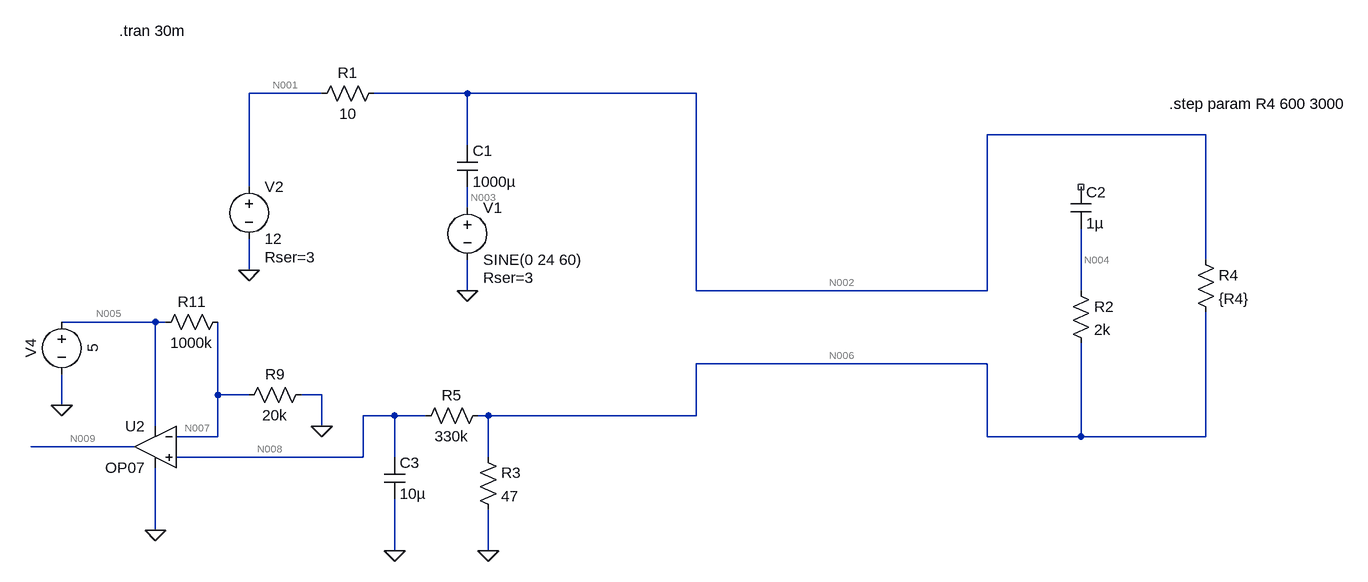
[diagram p0: schematic pbx.asc]
pbx.asc, the LTspice schematic file:
Version 4
SHEET 1 1648 1044
WIRE 16 32 -96 32
WIRE 240 32 96 32
WIRE 592 32 240 32
WIRE 1376 96 1040 96
WIRE 240 112 240 32
WIRE -96 176 -96 32
WIRE 240 208 240 176
WIRE 1376 288 1376 96
WIRE -96 304 -96 256
WIRE 240 336 240 288
WIRE 592 336 592 32
WIRE 1040 336 1040 96
WIRE 1040 336 592 336
WIRE 1184 336 1184 240
WIRE -240 384 -384 384
WIRE -224 384 -240 384
WIRE 1040 448 592 448
WIRE -144 496 -144 384
WIRE -96 496 -144 496
WIRE 16 496 -16 496
WIRE -384 512 -384 464
WIRE 128 528 80 528
WIRE 176 528 128 528
WIRE 272 528 256 528
WIRE 592 528 592 448
WIRE 592 528 272 528
WIRE -240 544 -240 384
WIRE 16 544 16 496
WIRE -144 560 -144 496
WIRE -144 560 -208 560
WIRE 1040 560 1040 448
WIRE 1184 560 1184 416
WIRE 1184 560 1040 560
WIRE 1376 560 1376 368
WIRE 1376 560 1184 560
WIRE -272 576 -432 576
WIRE 80 592 80 528
WIRE 80 592 -208 592
WIRE 128 592 128 528
WIRE 272 592 272 528
WIRE -240 704 -240 608
WIRE 128 736 128 656
WIRE 272 736 272 672
FLAG 240 336 0
FLAG -96 304 0
FLAG 272 736 0
FLAG 128 736 0
FLAG -240 704 0
FLAG 16 544 0
FLAG -384 512 0
SYMBOL voltage 240 192 R0
WINDOW 123 0 0 Left 0
WINDOW 39 24 124 Left 2
SYMATTR SpiceLine Rser=3
SYMATTR InstName V1
SYMATTR Value SINE(0 24 60)
SYMBOL voltage -96 160 R0
WINDOW 123 0 0 Left 0
WINDOW 39 24 124 Left 2
SYMATTR SpiceLine Rser=3
SYMATTR InstName V2
SYMATTR Value 12
SYMBOL cap 224 112 R0
SYMATTR InstName C1
SYMATTR Value 1000µ
SYMBOL res 0 48 R270
WINDOW 0 32 56 VTop 2
WINDOW 3 0 56 VBottom 2
SYMATTR InstName R1
SYMATTR Value 10
SYMBOL cap 1168 176 R0
SYMATTR InstName C2
SYMATTR Value 1µ
SYMBOL res 1168 320 R0
SYMATTR InstName R2
SYMATTR Value 2k
SYMBOL res 256 576 R0
SYMATTR InstName R3
SYMATTR Value 47
SYMBOL res 1360 272 R0
SYMATTR InstName R4
SYMATTR Value {R4}
SYMBOL cap 112 592 R0
SYMATTR InstName C3
SYMATTR Value 10µ
SYMBOL res 272 512 R90
WINDOW 0 0 56 VBottom 2
WINDOW 3 32 56 VTop 2
SYMATTR InstName R5
SYMATTR Value 330k
SYMBOL res 0 480 R90
WINDOW 0 0 56 VBottom 2
WINDOW 3 32 56 VTop 2
SYMATTR InstName R9
SYMATTR Value 20k
SYMBOL res -128 368 R90
WINDOW 0 0 56 VBottom 2
WINDOW 3 32 56 VTop 2
SYMATTR InstName R11
SYMATTR Value 1000k
SYMBOL voltage -384 368 R0
WINDOW 0 -32 56 VBottom 2
WINDOW 3 32 56 VTop 2
WINDOW 123 0 0 Left 0
WINDOW 39 0 0 Left 0
SYMATTR InstName V4
SYMATTR Value 5
SYMBOL Opamps\\OP07 -240 512 M0
SYMATTR InstName U2
TEXT 1320 48 Left 2 !.step param R4 600 3000
TEXT -296 -64 Left 2 !.tran 30m

The netlist it stands for:
* pbx.asc
V1 N003 0 SINE(0 24 60) Rser=3
V2 N001 0 12 Rser=3
C1 N002 N003 1000µ
R1 N001 N002 10
C2 NC_01 N004 1µ
R2 N004 N006 2k
R3 N006 0 47
R4 N002 N006 {R4}
C3 N008 0 10µ
R5 N006 N008 330k
R9 0 N007 20k
R11 N007 N005 1000k
V4 N005 0 5
XU2 N008 N007 N005 0 N009 LT1001  ; OP07, pins In+ In- V+ V- OUT
.step param R4 600 3000
.tran 30m
.lib LTC.lib
.backanno
.end

* Results of the author's LTspice run, read from the files saved beside the schematic
* Operating Point (first step), zero values left out:
*   r4 = 600 
*   V(n001) = 11.95 V
*   V(n002) = 11.76 V
*   V(n004) = 854.5 mV
*   V(n006) = 854.5 mV
*   V(n008) = 851.2 mV
*   V(n007) = 98.24 mV
*   V(n005) = 5 V
*   V(n009) = 4.07 V
*   I(R11) = -4.902 µA
*   I(R9) = -4.912 µA
*   I(R5) = 10.16 nA
*   I(R4) = 18.18 mA
*   I(R3) = 18.18 mA
*   I(R1) = 18.18 mA
*   I(V4) = -2.252 mA
*   I(V2) = -18.18 mA
*   Ix(u2:1) = 10.16 nA
*   Ix(u2:2) = -10.17 nA
*   Ix(u2:3) = 2.247 mA
*   Ix(u2:4) = -2.253 mA
*   Ix(u2:5) = -3.14 pA
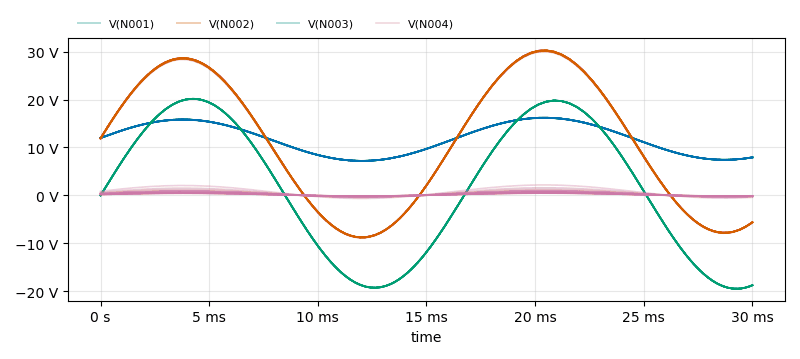
[diagram p1: Transient Analysis of pbx.asc, plotted from the saved traces]
* Transient Analysis, 11 runs:
*   V(N001) [r4=600]: min 7.185 V, max 16.16 V, average 11.82 V, rms 12.23 V, last 7.917 V
*   V(N001) [r4=840]: min 7.195 V, max 16.18 V, average 11.84 V, rms 12.25 V, last 7.925 V
*   V(N001) [r4=1080]: min 7.201 V, max 16.2 V, average 11.84 V, rms 12.25 V, last 7.93 V
*   V(N001) [r4=1320]: min 7.204 V, max 16.2 V, average 11.85 V, rms 12.26 V, last 7.933 V
*   V(N001) [r4=1560]: min 7.205 V, max 16.21 V, average 11.85 V, rms 12.26 V, last 7.935 V
*   V(N001) [r4=1800]: min 7.207 V, max 16.21 V, average 11.86 V, rms 12.27 V, last 7.937 V
*   V(N001) [r4=2040]: min 7.209 V, max 16.21 V, average 11.86 V, rms 12.27 V, last 7.938 V
*   V(N001) [r4=2280]: min 7.21 V, max 16.21 V, average 11.86 V, rms 12.27 V, last 7.939 V
*   V(N002) [r4=600]: min -8.863 V, max 30.04 V, average 11.22 V, rms 17.63 V, last -5.692 V
*   V(N002) [r4=840]: min -8.821 V, max 30.12 V, average 11.29 V, rms 17.69 V, last -5.657 V
*   V(N002) [r4=1080]: min -8.797 V, max 30.18 V, average 11.33 V, rms 17.72 V, last -5.637 V
*   V(N002) [r4=1320]: min -8.781 V, max 30.2 V, average 11.35 V, rms 17.74 V, last -5.624 V
*   V(N002) [r4=1560]: min -8.777 V, max 30.23 V, average 11.37 V, rms 17.75 V, last -5.614 V
*   V(N002) [r4=1800]: min -8.768 V, max 30.23 V, average 11.38 V, rms 17.76 V, last -5.607 V
*   V(N002) [r4=2040]: min -8.762 V, max 30.25 V, average 11.39 V, rms 17.77 V, last -5.602 V
*   V(N002) [r4=2280]: min -8.757 V, max 30.26 V, average 11.4 V, rms 17.78 V, last -5.597 V
*   V(N003) [r4=600]: min -19.44 V, max 20.14 V, average 1.586 V, rms 14.06 V, last -18.72 V
*   V(N003) [r4=840]: min -19.45 V, max 20.15 V, average 1.585 V, rms 14.08 V, last -18.73 V
*   V(N003) [r4=1080]: min -19.46 V, max 20.16 V, average 1.584 V, rms 14.08 V, last -18.74 V
*   V(N003) [r4=1320]: min -19.47 V, max 20.16 V, average 1.584 V, rms 14.09 V, last -18.75 V
*   V(N003) [r4=1560]: min -19.48 V, max 20.16 V, average 1.584 V, rms 14.09 V, last -18.75 V
*   V(N003) [r4=1800]: min -19.49 V, max 20.17 V, average 1.583 V, rms 14.09 V, last -18.75 V
*   V(N003) [r4=2040]: min -19.49 V, max 20.17 V, average 1.583 V, rms 14.1 V, last -18.76 V
*   V(N003) [r4=2280]: min -19.49 V, max 20.18 V, average 1.583 V, rms 14.1 V, last -18.76 V
*   V(N004) [r4=600]: min -643.6 mV, max 2.182 V, average 815.3 mV, rms 1.281 V, last -413.3 mV
*   V(N004) [r4=840]: min -467.3 mV, max 1.596 V, average 598.1 mV, rms 937.1 mV, last -299.6 mV
*   V(N004) [r4=1080]: min -366.8 mV, max 1.258 V, average 472.3 mV, rms 738.8 mV, last -235 mV
*   V(N004) [r4=1320]: min -301.8 mV, max 1.038 V, average 390.3 mV, rms 609.8 mV, last -193.3 mV
*   V(N004) [r4=1560]: min -256.6 mV, max 883.9 mV, average 332.5 mV, rms 519.2 mV, last -164.1 mV
*   V(N004) [r4=1800]: min -223.1 mV, max 769.3 mV, average 289.6 mV, rms 452 mV, last -142.6 mV
*   V(N004) [r4=2040]: min -197.3 mV, max 681.1 mV, average 256.5 mV, rms 400.2 mV, last -126.1 mV
*   V(N004) [r4=2280]: min -176.8 mV, max 611.1 mV, average 230.2 mV, rms 359 mV, last -113 mV